# EAGLE design XbeeOnBoard (EAGLE 8.3.1)
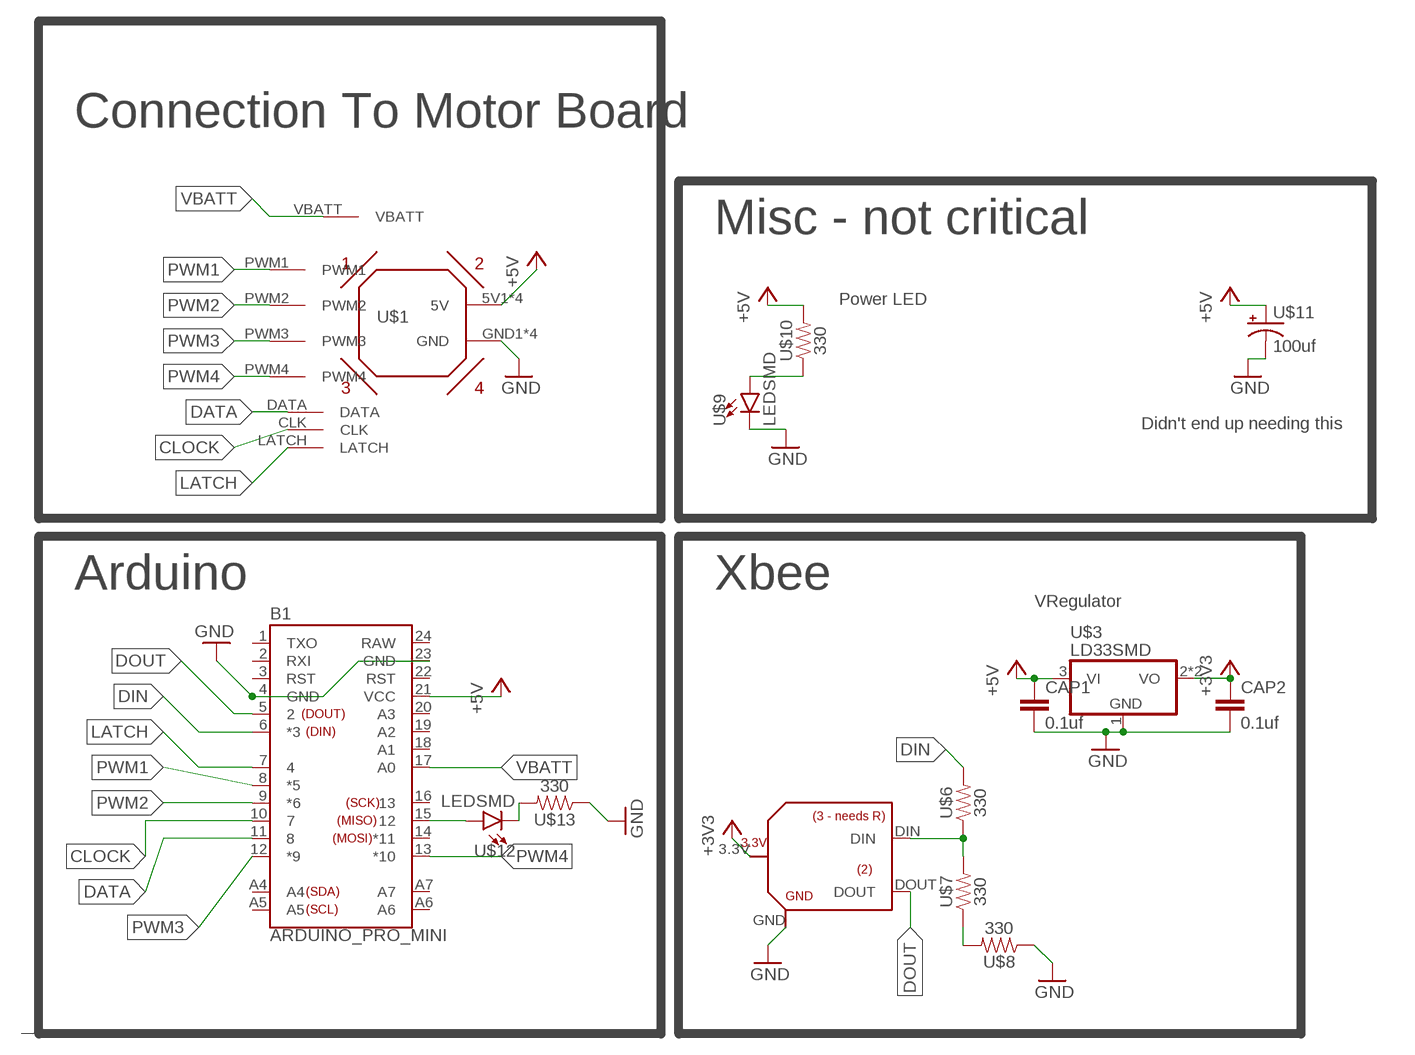
[diagram p0: schematic, sheet 1]

## Parts
B1  ARDUINO_PRO_MINI  [ARDUINO_PRO_MINI]
CAP1  0.1uf  CAP_SMCAP  [C1206]
CAP2  0.1uf  CAP_SMCAP  [C1206]
U$1  OMNIBOARD  [OMNIBOARD]
U$2  XBEE_BOUT  [XBEE_BOUT]
U$3  LD33SMD  [SOT223]
U$6  330  RESISTORSMD  [R1206]
U$7  330  RESISTORSMD  [R1206]
U$8  330  RESISTORSMD  [R1206]
U$9  LEDSMD  [LED_SMD]
U$10  330  RESISTORSMD  [R1206]
U$11  100uf  CAP_EMED  [CAP_E]
U$12  LEDSMD  [LED_SMD]
U$13  330  RESISTORSMD  [R1206]

## Nets
+3V3 [pow]: CAP2.1 U$2.3.3V U$3.2(VO) U$3.4(VO)
+5V [pow]: B1.21(VCC) CAP1.1 U$1.5V1(5V) U$1.5V2(5V) U$1.5V3(5V) U$1.5V4(5V) U$3.3(VI) U$10.2 U$11.+
CLOCK: B1.10 U$1.CLK
DATA: B1.11 U$1.DATA
DIN: B1.6(*3) U$6.2
DOUT: B1.5 U$2.DOUT
GND [pow]: B1.4(GND) B1.23(GND) CAP1.2 CAP2.2 U$1.GND1(GND) U$1.GND2(GND) U$1.GND3(GND) U$1.GND4(GND) U$2.GND U$3.1(GND) U$8.1 U$9.C U$11.- U$13.1
LATCH: B1.7 U$1.LATCH
N$1: U$9.A U$10.1
N$2: B1.15 U$12.A
N$3: U$7.1 U$8.2
N$4: U$2.DIN U$6.1 U$7.2
N$5: U$12.C U$13.2
PWM1: B1.8(*5) U$1.PWM1
PWM2: B1.9(*6) U$1.PWM2
PWM3: B1.12(*9) U$1.PWM3
PWM4: B1.13(*10) U$1.PWM4
VBATT: B1.17(A0) U$1.VBATT
Unconnected: B1.1(TXO) B1.2(RXI) B1.3(RST) B1.14(*11) B1.16 B1.18(A1) B1.19(A2) B1.20(A3) B1.22(RST) B1.A4 B1.A5 B1.A6 B1.A7

## Notes on the sheet
- Connection To Motor Board
- Misc - not critical
- Power LED
- Didn't end up needing this
- Arduino | Xbee
- VRegulator

## Power pins joined to a net without a drawn wire
RAW: B1.24(RAW)

## Library data of the parts
B1 = Richard_Micros:ARDUINO_PRO_MINI: SparkFun Pro Mini Pro Mini compatible footprint. Dimensions: 0.7 x 1.3" PCB Thickness: 0.8mm SparkFun Products: 3.3V/8MHz <https://www.sparkfun.com/products/11114> 5V/16MHz <https://www.sparkfun.com/products/11113>
CAP1 CAP2 = Richard_Components:CAP_SM
U$1 = Richard:OMNIBOARD
U$2 = Richard_Boards:XBEE_BOUT
U$3 = Richard_Components:LD33
U$6-U$8 U$10 U$13 = Richard_Components:RESISTOR
U$9 U$12 = Richard_Components:LED
U$11 = Richard_Components:CAP_E

## Net classes
0 default: width 0.254 mm
1 pow: width 0.508 mm

## Board
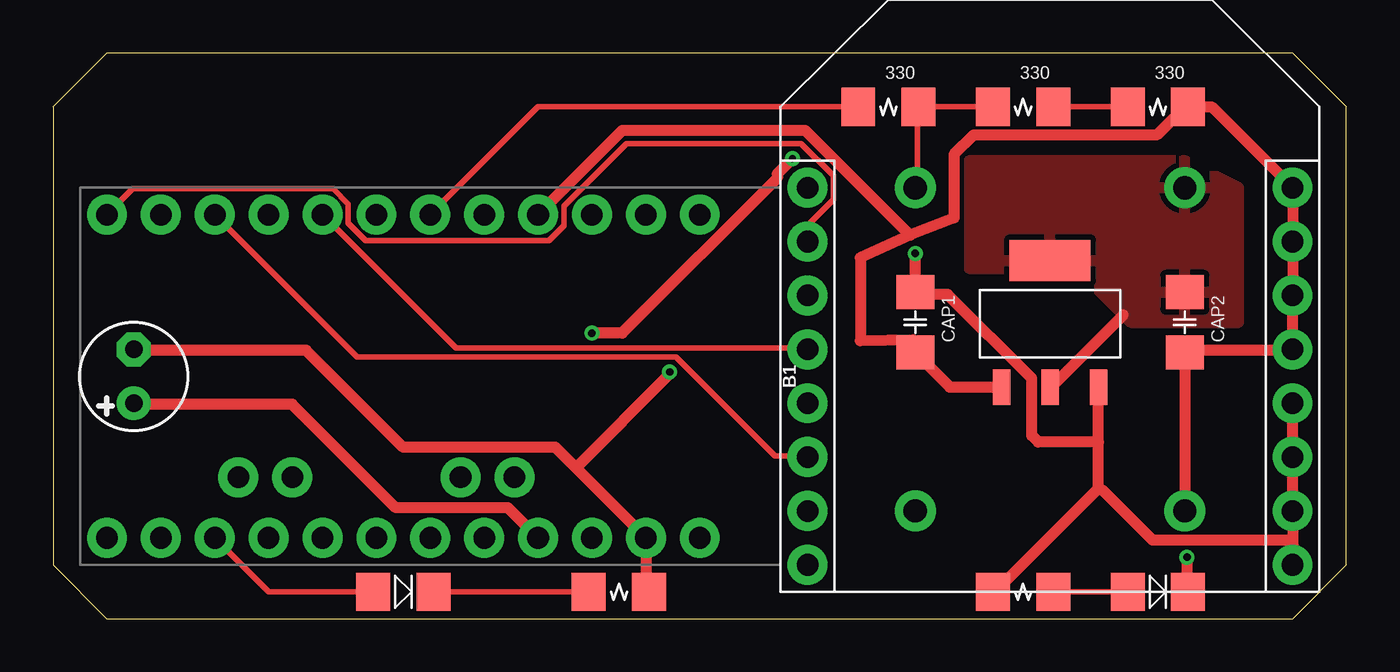
[diagram p1: board, top side]
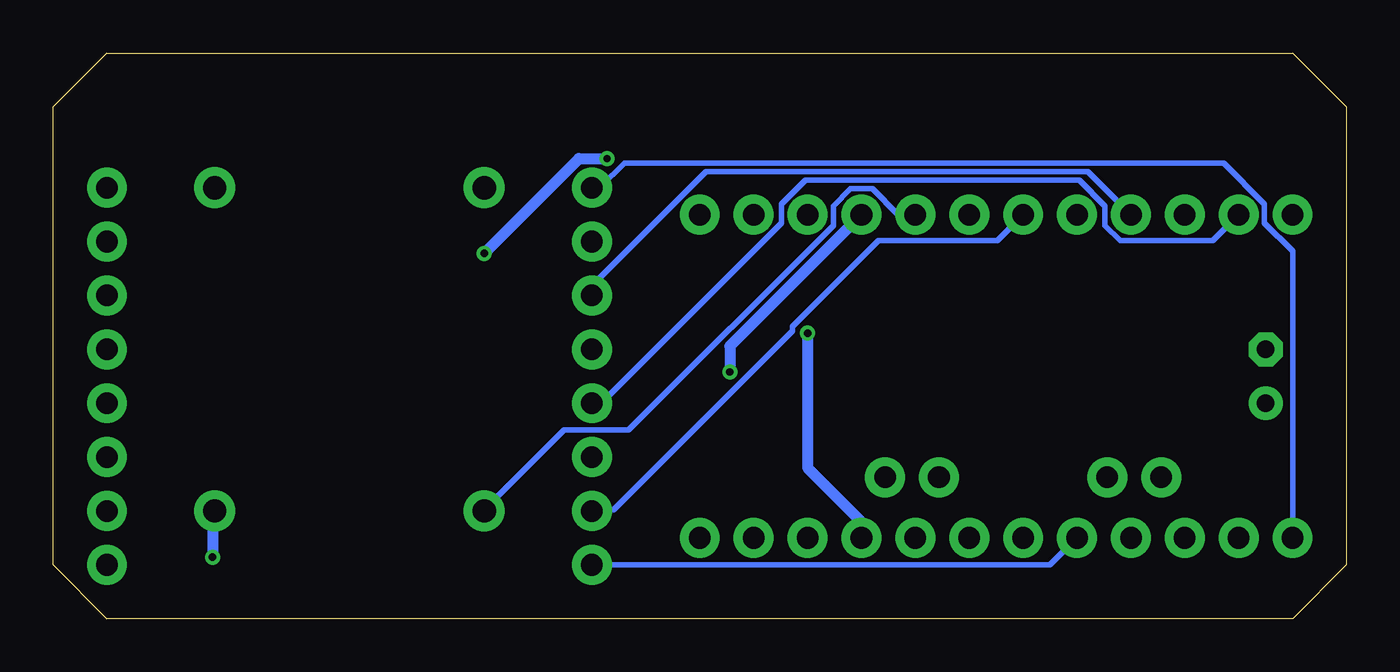
[diagram p2: board, bottom side, seen from below]

Size 60.96 x 26.67 mm. Coordinates in mm from the lower left corner, seen from the top.
Outline: 2.54,0 58.42,0 60.96,2.54 60.96,24.13 58.42,26.67 2.54,26.67 0,24.13 0,2.54 2.54,0
Copper layers (1*16): Top 0.0356mm / dielectric 1.5011mm / Bottom 0.0356mm
Design rules "LaenPCBOrder": minimum track width 6mil, minimum drill 13mil, track to track 6mil, track to pad 6mil, pad to pad 6mil, via to via 6mil, smd to smd 6mil, copper to edge 15mil, drill to drill 6mil, minimum pad ring 7mil, minimum via ring 7mil, stop-mask expansion 3mil, vias tented up to drill 0mil, thermal gap 10mil

### Footprints (pad centres in the part's own frame; a part is rotated, then mirrored left to right if it is on the bottom)
ARDUINO_PRO_MINI = drill 1.016 pad 1.88: 1 -7.62,12.7; 2 -7.62,10.16; 3 -7.62,7.62; 4 -7.62,5.08; 5 -7.62,2.54; 6 -7.62,0; 7 -7.62,-2.54; 8 -7.62,-5.08; 9 -7.62,-7.62; 10 -7.62,-10.16; 11 -7.62,-12.7; 12 -7.62,-15.24; 13 7.62,-15.24; 14 7.62,-12.7; 15 7.62,-10.16; 16 7.62,-7.62; 17 7.62,-5.08; 18 7.62,-2.54; 19 7.62,0; 20 7.62,2.54; 21 7.62,5.08; 22 7.62,7.62; 23 7.62,10.16; 24 7.62,12.7; A4 4.763,1.429; A5 4.763,3.969; A6 4.763,-9.049; A7 4.763,-6.509
C1206 = smd 1.6 x 1.803: 1 -1.422,0; 2 1.422,0
OMNIBOARD = drill 1.016 pad 1.88: 5V1 11.43,-1.27; 5V2 11.43,-3.81; 5V3 11.43,-6.35; 5V4 11.43,-8.89; CLK -11.43,-3.81; DATA -11.43,-1.27; GND1 11.43,8.89; GND2 11.43,6.35; GND3 11.43,3.81; GND4 11.43,1.27; LATCH -11.43,-6.35; PWM1 -11.43,1.27; PWM2 -11.43,3.81; PWM3 -11.43,6.35; PWM4 -11.43,8.89; VBATT -11.43,-8.89
XBEE_BOUT = drill 1.1 pad 1.93: 3.3V -7.62,6.35; DIN -7.62,-6.35; DOUT 7.62,-6.35; GND 7.62,6.35
SOT223 = smd 0.813 x 1.676: 1 -2.286,-3.048; 2 0,-3.048; 3 2.286,-3.048 | smd 3.81 x 1.93: 4 0,2.921
R1206 = smd 1.6 x 1.803: 1 -1.422,0; 2 1.422,0
LED_SMD = smd 1.6 x 1.803: A -1.422,0; C 1.422,0
CAP_E = drill 0.813 pad 1.6: + -1.27,0 | drill 0.813 pad 1.6 octagon: - 1.27,0

### Placement (x,y rotation side)
B1  17.78,11.43 270 top
CAP1  40.64,13.97 270 top
CAP2  53.34,13.97 270 top
U$1  46.99,11.43 0 top
U$2  46.99,12.7 270 top
U$3  46.99,13.97 0 top
U$6  39.37,24.13 180 top
U$7  45.72,24.13 180 top
U$8  52.07,24.13 180 top
U$9  52.07,1.27 0 top
U$10  45.72,1.27 180 top
U$11  3.81,11.43 90 top
U$12  16.51,1.27 0 top
U$13  26.67,1.27 180 top

### Tracks (layer width: path | path; a pad name or v marks a point on that pad's centre or on a via)
+3V3
  Top 0.508: 50.44,14.33 47.04,10.92 U$3.2
  pour Top: 43.18,16.51 48.26,16.51 50.8,13.97 55.88,13.97 55.88,20.32 53.34,21.59 43.18,21.59
+5V  (via drill 0.35)
  Top 0.508: B1.21 21.44,5.23 16.15,5.23 11.28,10.11 3.86,10.11 U$11.+ | 58.42,3.71 U$1.5V3 U$1.5V2 U$1.5V1 | 58.42,3.71 U$1.5V4 | 49.28,6.15 49.28,8.33 | 49.28,8.33 U$3.3 | 49.28,6.15 44.4,1.27 U$10.2 | 49.28,8.33 46.43,8.33 46.13,8.64 46.13,11.33 42.16,15.29 40.64,15.29 CAP1.1 v40.64,17.22 | 58.42,3.71 51.82,3.71 49.48,6.04 49.28,6.15 | v25.4,13.46 26.82,13.46 34.14,20.78 34.14,20.98 v34.85,21.69
  Bottom 0.508: B1.21 22.86,4.57 25.4,7.11 v25.4,13.46 | v34.85,21.69 36.17,21.69 v40.64,17.22
CLOCK
  Top 0.254: B1.10 14.33,12.34 29.36,12.34 34.04,7.67 35.56,7.67 U$1.CLK
DATA
  Bottom 0.254: B1.11 6.3,17.83 10.67,17.83 11.38,18.54 11.38,19.46 12.6,20.68 25.5,20.68 26.62,19.56 26.62,18.64 35.05,10.21 35.56,10.21 U$1.DATA
DIN
  Top 0.254: U$6.2 22.86,24.13 B1.6
DOUT
  Bottom 0.254: B1.5 21.13,19.05 22.35,20.27 23.37,20.27 24.18,19.46 24.18,18.54 33.83,8.89 36.88,8.89 40.64,5.13 U$2.DOUT
GND  (via drill 0.35)
  Top 0.508: 24.64,7.11 B1.23 27.94,1.42 U$13.1 | 24.64,7.11 23.67,8.08 16.51,8.08 11.94,12.65 3.86,12.65 U$11.- | v53.44,2.9 53.44,1.27 U$9.C | U$2.GND CAP2.2 53.34,12.65 58.42,12.65 U$1.GND4 U$1.GND3 U$1.GND2 U$1.GND1 54.61,24.13 U$8.1 53.24,24.03 52.02,22.81 43.38,22.81 42.47,21.89 42.47,18.9 40.39,18.09 | U$3.1 42.27,10.92 CAP1.2 | CAP1.2 | 40.39,18.09 38.05,17.02 38.05,13.11 40.54,13.16 40.54,12.75 CAP1.2 | B1.4 26.82,23.01 35.46,23.01 40.39,18.09 | 24.64,7.11 29.06,11.53 v29.06,11.63
  Bottom 0.508: v53.44,2.9 53.44,4.93 53.34,5.03 U$2.GND | v29.06,11.63 29.06,12.85 B1.4
LATCH
  Bottom 0.254: B1.7 16.46,17.83 22.05,17.83 26.11,13.77 26.11,13.56 34.54,5.13 35.56,5.13 U$1.LATCH
N$1
  Top 0.254: U$9.A U$10.1
N$2
  Top 0.254: U$12.A 10.16,1.27 B1.15
N$3
  Top 0.254: U$8.2 U$7.1
N$4
  Top 0.254: U$7.2 U$6.1 40.74,24.03 40.74,20.47 40.64,20.37 U$2.DIN
N$5
  Top 0.254: U$13.2 U$12.C
PWM1
  Top 0.254: B1.8 19,12.75 35.56,12.75 U$1.PWM1
PWM2
  Bottom 0.254: U$1.PWM2 35.56,15.7 30.18,21.08 12.19,21.08 B1.9
PWM3
  Top 0.254: U$1.PWM3 35.56,18.54 36.78,19.76 36.78,20.88 35.26,22.4 27.03,22.4 24.08,19.46 24.08,18.54 23.37,17.83 14.73,17.83 13.92,18.64 13.92,19.56 13.21,20.27 3.76,20.27 B1.12
PWM4
  Bottom 0.254: B1.13 2.54,17.32 3.86,18.64 3.86,19.56 5.79,21.49 34.04,21.49 35.15,20.37 35.56,20.37 U$1.PWM4
VBATT
  Bottom 0.254: B1.17 13.97,2.54 U$1.VBATT